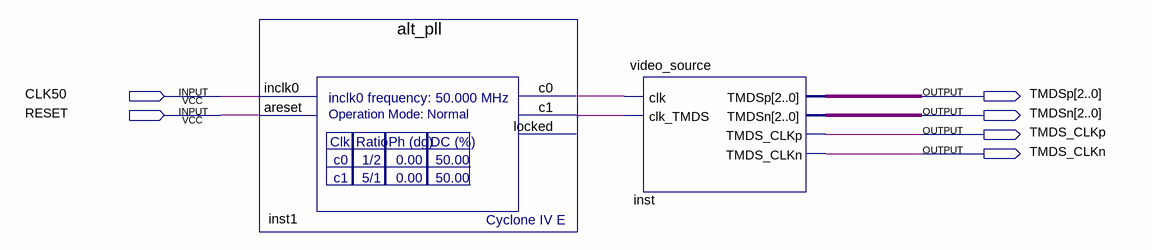
[diagram p0: schematic sheet]
// Quartus schematic DVI_Tester.bdf as structural Verilog: 2 symbols, 6 pins
module DVI_Tester (
  input  CLK50,
  input  RESET,
  output [2:0] TMDSp,
  output [2:0] TMDSn,
  output TMDS_CLKp,
  output TMDS_CLKn
);

  wire inst1_c0, inst1_c1;

  alt_pll inst1 (.inclk0(CLK50), .areset(RESET), .c0(inst1_c0), .c1(inst1_c1));  // open: locked
  video_source inst (
    .clk(inst1_c0), .clk_TMDS(inst1_c1), .TMDSp(TMDSp), .TMDSn(TMDSn), .TMDS_CLKp(TMDS_CLKp),
    .TMDS_CLKn(TMDS_CLKn));
endmodule
